# Altium schematic sheet Toggle.SchDoc
size A
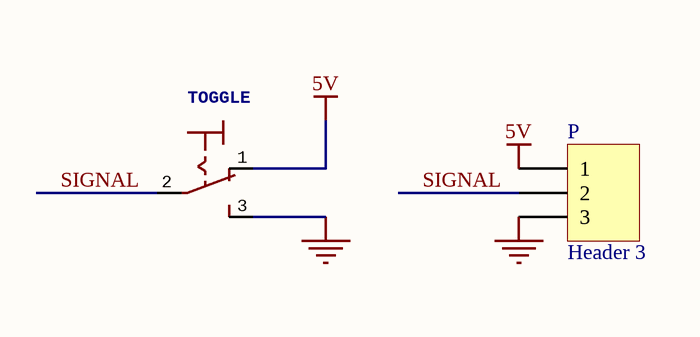
[diagram p0: Toggle.SchDoc]

## Parts
P  Header 3  [B3B-PH-K-S(LF)(SN)]
TOGGLE  5636AB9  [320-916]  (value not drawn)

## Nets
5V: P.1 TOGGLE.1(O)
GND: P.3 TOGGLE.3(S)
SIGNAL: P.2 TOGGLE.2(P)

## Library data of the parts
P = Header 3: CONN HEADER VERT 3POS 2MM; Manufacturer 1: JST; Number of Positions: 3; Connector Type: Male Pin; Current Rating: 2A; Contact Resistance: 20mR; Voltage Rating (AC): 100V; Insulation Resistance: 1MR; Gender: Male; LatestRevisionDate: 17-Jul-2002; LatestRevisionNote: Re-released for DXP Platform.; Publisher: Altium Limited; Supplier 1: Digi-Key; Supplier Part Number 1: 455-1705-ND; Manufacturer Part Number 1: B3B-PH-K-S(LF)(SN); Stock 1: 143844; Pricing 1: 1=0.19000, 10=0.18200, 100=0.12620, 500=0.10676, 1000=0.08736, 5000=0.07765, 10000=0.07037 (USD); RoHS: Yes; Mount: Through Hole; Number of Pins: 3; Contact Plating: Tin,Copper; Color: Natural; Contact Material: Brass,Tin; Housing Color: White; Housing Material: Polyamide; Min Operating Temperature: -25°C; Max Operating Temperature: 85°C; Number of Rows: 1; Packaging: Bulk; Max Current Rating: 2A; Number of Poles: 3; Voltage Rating: 100V; Termination: Solder; Fastening Type: Detent; Number of Contacts: 3; Max Voltage Rating (AC): 100V; Max Voltage Rating (DC): 100V; Working Voltage: 100V; Orientation: Straight; Length: 7.9mm; Height: 9.4mm; Pitch: 2mm; Width: 4.5mm; Lead Pitch: 2mm; Contact Mating Length: 0.13inch; Depth: 4.5mm; Lead Free: Lead Free; REACH SVHC: No SVHC; ComponentLink1URL: https://datasheet.ciiva.com/6747/80560-6747401.pdf?src-supplier=Newark; ComponentLink1Description: https://datasheet.ciiva.com/6747/80560-6747401.pdf?src-supplier=Newark; ComponentLink2URL: https://datasheet.ciiva.com/11746/0900766b80826550-11746939.pdf?src-supplier=RSComponents; ComponentLink2Description: https://datasheet.ciiva.com/11746/0900766b80826550-11746939.pdf?src-supplier=RSComponents; ComponentLink3URL: https://datasheet.ciiva.com/26894/getdatasheetpartid-448114-26894774.pdf?src-supplier=Verical; ComponentLink3Description: https://datasheet.ciiva.com/26894/getdatasheetpartid-448114-26894774.pdf?src-supplier=Verical; ComponentLink4URL: https://datasheet.ciiva.com/712/eph-712455.pdf?src-supplier=Digi-Key; ComponentLink4Description: https://datasheet.ciiva.com/712/eph-712455.pdf?src-supplier=Digi-Key; ComponentLink5URL: https://datasheet.ciiva.com/26924/getdatasheetpartid-651387-26924028.pdf?src-supplier=Verical; ComponentLink5Description: https://datasheet.ciiva.com/26924/getdatasheetpartid-651387-26924028.pdf?src-supplier=Verical; ComponentLink6URL: https://datasheet.ciiva.com/16200/eph-16200926.pdf?src-supplier=Future+Electronics; ComponentLink6Description: https://datasheet.ciiva.com/16200/eph-16200926.pdf?src-supplier=Future+Electronics; ComponentLink7URL: https://datasheet.ciiva.com/43491/741202-da-01-en-stiftleiste-gerade-3-pol-rm2-0-43491962.pdf?src-supplier=Conrad; ComponentLink7Description: https://datasheet.ciiva.com/43491/741202-da-01-en-stiftleiste-gerade-3-pol-rm2-0-43491962.pdf?src-supplier=Conrad
TOGGLE = 320-916: SWITCH TOGGLE SPDT 6A 125V; Manufacturer 1: APEM; Manufacturer Part Number 1: 5636A9; Actuator Material: Nylon,Polyamide,Brass; Mechanical Life: 100000Cycles; Contact Current Rating: 4A; Voltage Rating (DC): 30V; Contact Resistance: 10mR; Max Voltage Rating (AC): 250V; Illumination Type: Non-Illuminated,Illuminated; Electrical Life: 50000Cycles; Switch Function: On-On; Actuator Length: 11.4mm; ComponentLink1URL: https://datasheet.ciiva.com/7986/94098-7986892.pdf?src-supplier=Element14; ComponentLink1Description: https://datasheet.ciiva.com/7986/94098-7986892.pdf?src-supplier=Element14; ComponentLink2URL: https://datasheet.ciiva.com/14142/03522208-14142796.pdf?src-supplier=Distrelec; ComponentLink2Description: https://datasheet.ciiva.com/14142/03522208-14142796.pdf?src-supplier=Distrelec; Supplier 1: Mouser; Stock 1: 294; Pricing 1: 1=8.04000, 25=7.62000, 50=7.19000, 100=6.98000, 250=5.92000, 500=5.71000 (USD); RoHS: Yes; Mount: Panel; Case/Package: 125; Housing Material: Stainless Steel; Contact Material: Silver; Min Operating Temperature: -40°C; Max Operating Temperature: 85°C; Voltage Rating (AC): 125V; Throw Configuration: SPDT; Package Quantity: 50; Current Rating: 4A; Packaging: Bulk; Max Current Rating: 6A; Max Voltage Rating (DC): 30V; Orientation: Straight; Termination: Solder; Length: 13.2mm; REACH SVHC: No SVHC; ComponentLink3URL: https://datasheet.ciiva.com/1533/1697793-1533110.pdf?src-supplier=Element14; ComponentLink3Description: https://datasheet.ciiva.com/1533/1697793-1533110.pdf?src-supplier=Element14; Supplier Part Number 1: 642-5636A9